# EAGLE schematic MainBoardSchematic (EAGLE 7.2.0)
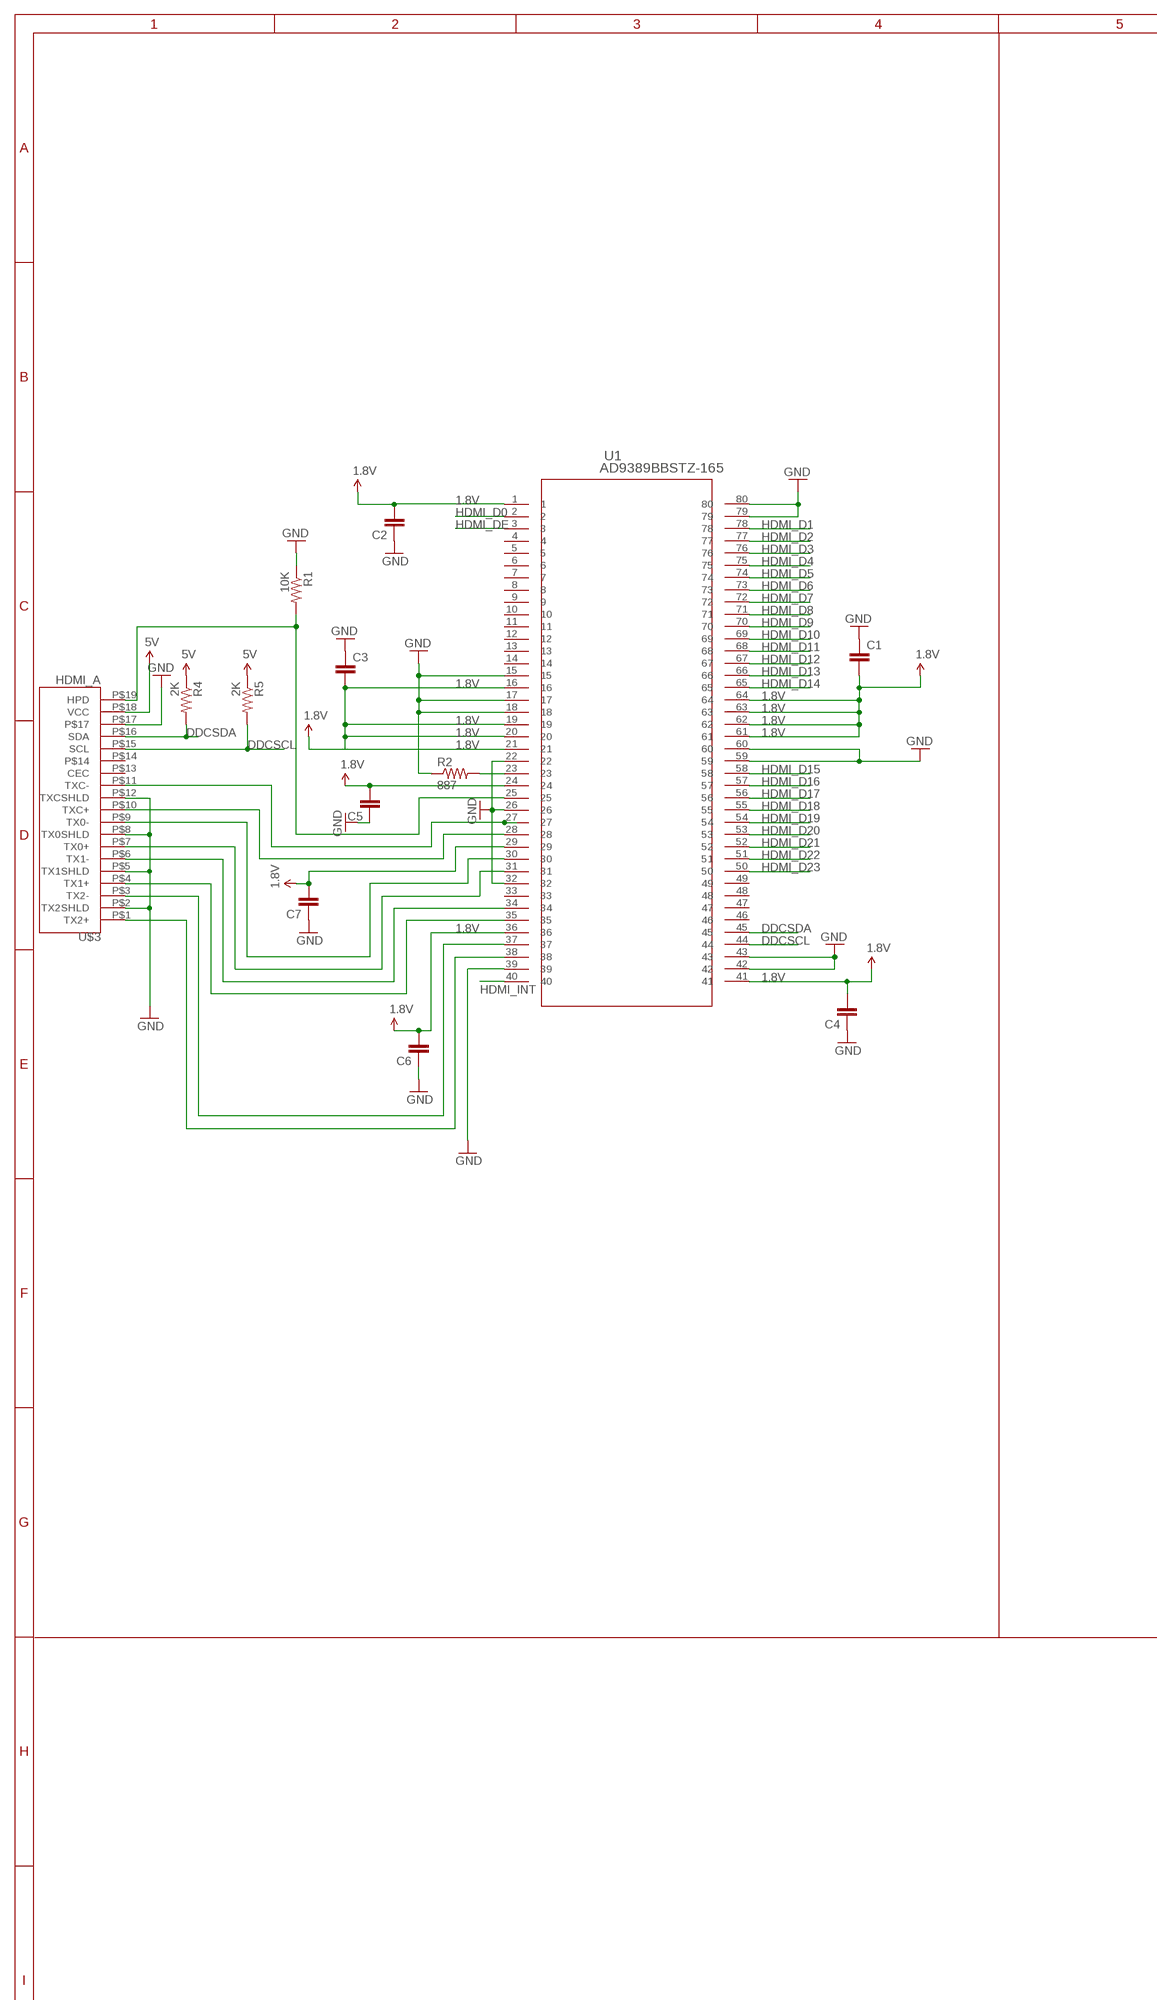
[diagram p0: schematic, sheet 1, part 1 of 2]
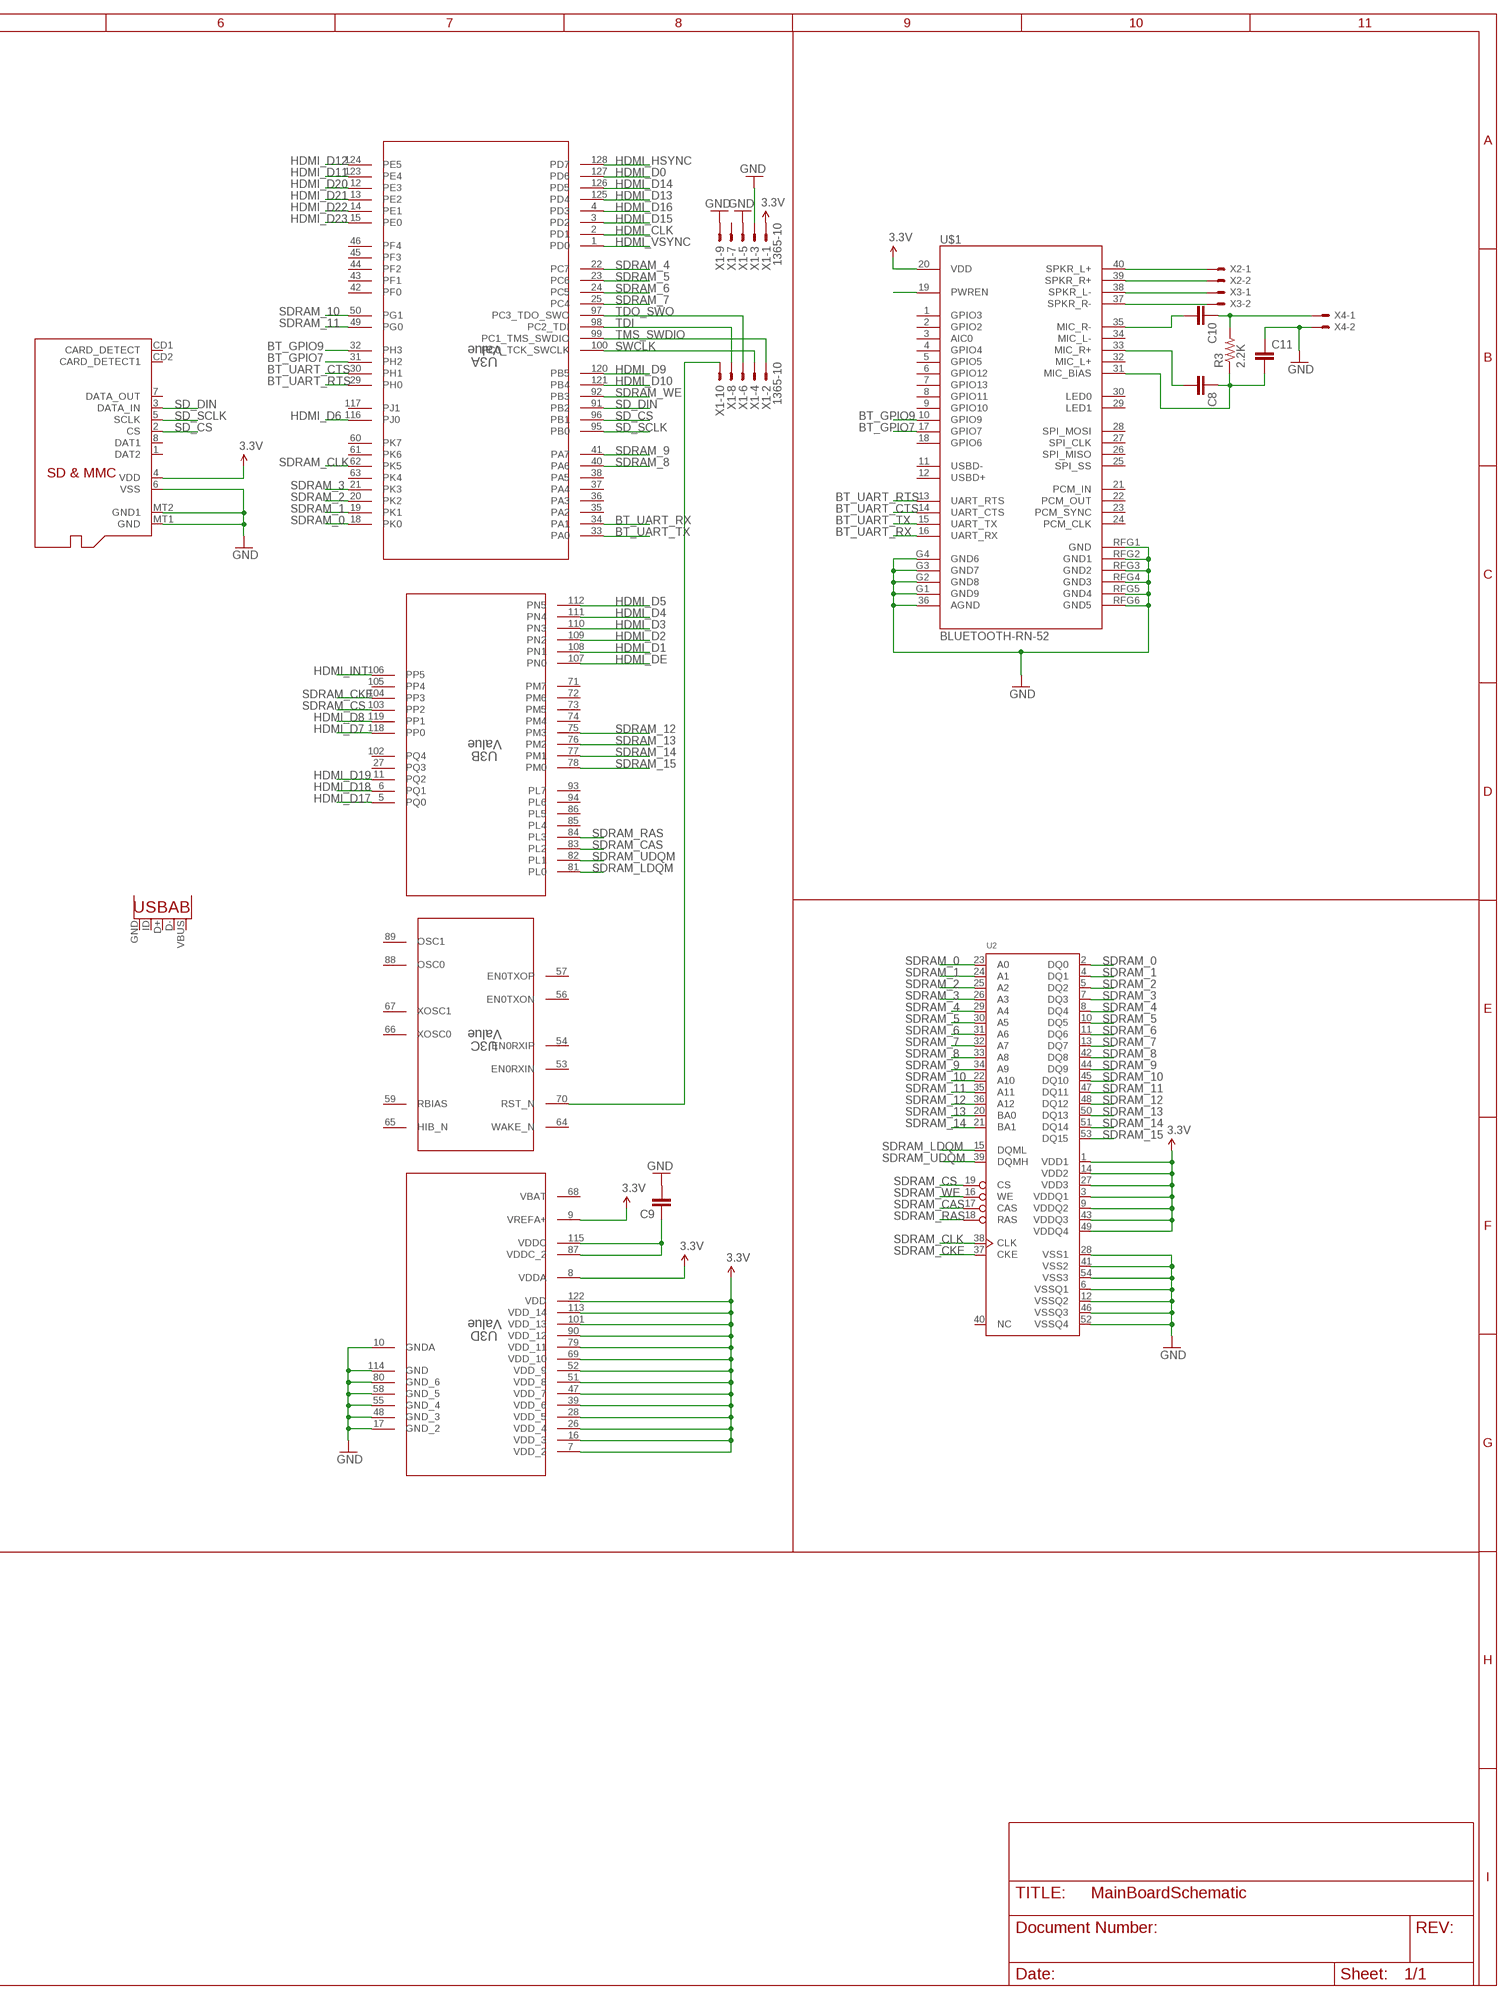
[diagram p1: schematic, sheet 1, part 2 of 2]

## Parts
C1  0.1UF-50V-20%(PTH)KIT-EZ  [CAP-PTH-SMALL-KIT]
C2  0.1UF-50V-20%(PTH)KIT-EZ  [CAP-PTH-SMALL-KIT]
C3  0.1UF-50V-20%(PTH)KIT-EZ  [CAP-PTH-SMALL-KIT]
C4  0.1UF-50V-20%(PTH)KIT-EZ  [CAP-PTH-SMALL-KIT]
C5  0.1UF-50V-20%(PTH)KIT-EZ  [CAP-PTH-SMALL-KIT]
C6  0.1UF-50V-20%(PTH)KIT-EZ  [CAP-PTH-SMALL-KIT]
C7  0.1UF-50V-20%(PTH)KIT-EZ  [CAP-PTH-SMALL-KIT]
C8  0.1UF-50V-20%(PTH)KIT-EZ  [CAP-PTH-SMALL-KIT]
C9  0.1UF-50V-20%(PTH)KIT-EZ  [CAP-PTH-SMALL-KIT]
C10  0.1UF-50V-20%(PTH)KIT-EZ  [CAP-PTH-SMALL-KIT]
C11  0.1UF-50V-20%(PTH)KIT-EZ  [CAP-PTH-SMALL-KIT]
R1  10K  RESISTOR1206  [1206]
R2  887  RESISTOR1206  [1206]
R3  2.2K  RESISTOR1206  [1206]
R4  2K  RESISTOR1206  [1206]
R5  2K  RESISTOR1206  [1206]
U1  AD9389BBSTZ-165  [ST_80_2]
U2  SDRAM_54TSOP  [TSOP54-400]
U3  Value  TM4C129ENCPDTI3R  [PDT0128A_N]
U4  USB-AB  [USB-AB-MICRO-SMD]
U$1  BLUETOOTH-RN-52  [RN-52]
U$2  MICROSD  [MICROSD]
U$3  HDMI_A  [HDMI_A_SMD]
X1  1365-10  [1365-10]
X2  KK-156-2  [KK-156-2]
X3  KK-156-2  [KK-156-2]
X4  KK-156-2  [KK-156-2]

## Nets
1.8V: C1.2 C2.2 C3.2 C4.2 C5.2 C6.2 C7.2 U1.1 U1.16 U1.19 U1.20 U1.21 U1.24 U1.29 U1.36 U1.41 U1.61 U1.62 U1.63 U1.64
3.3V: U2.1(VDD1) U2.3(VDDQ1) U2.9(VDDQ2) U2.14(VDD2) U2.27(VDD3) U2.43(VDDQ3) U2.49(VDDQ4) U3.7(D:VDD_2) U3.8(D:VDDA) U3.9(D:VREFA+) U3.16(D:VDD_3) U3.26(D:VDD_4) U3.28(D:VDD_5) U3.39(D:VDD_6) U3.47(D:VDD_7) U3.51(D:VDD_8) U3.52(D:VDD_9) U3.69(D:VDD_10) U3.79(D:VDD_11) U3.90(D:VDD_12) U3.101(D:VDD_13) U3.113(D:VDD_14) U3.122(D:VDD) U$1.20(VDD) U$2.4(VDD) X1.1
5V: R4.1 R5.1 U$3.P$18(VCC)
BT_GPIO7: U3.31(A:PH2) U$1.17(GPIO7)
BT_GPIO9: U3.32(A:PH3) U$1.10(GPIO9)
BT_UART_CTS: U3.30(A:PH1) U$1.14(UART_CTS)
BT_UART_RTS: U3.29(A:PH0) U$1.13(UART_RTS)
BT_UART_RX: U3.34(A:PA1) U$1.16(UART_RX)
BT_UART_TX: U3.33(A:PA0) U$1.15(UART_TX)
DDCSCL: R5.2 U1.44 U$3.P$15(SCL)
DDCSDA: R4.2 U1.45 U$3.P$16(SDA)
GND: C1.1 C2.1 C3.1 C4.1 C5.1 C6.1 C7.1 C9.2 C11.1 R1.1 R2.1 U1.15 U1.17 U1.18 U1.22 U1.26 U1.32 U1.39 U1.42 U1.43 U1.59 U1.60 U1.79 U1.80 U2.6(VSSQ1) U2.12(VSSQ2) U2.28(VSS1) U2.41(VSS2) U2.46(VSSQ3) U2.52(VSSQ4) U2.54(VSS3) U3.10(D:GNDA) U3.17(D:GND_2) U3.48(D:GND_3) U3.55(D:GND_4) U3.58(D:GND_5) U3.80(D:GND_6) U3.114(D:GND) U$1.36(AGND) U$1.G1(GND9) U$1.G2(GND8) U$1.G3(GND7) U$1.G4(GND6) U$1.RFG1(GND) U$1.RFG2(GND1) U$1.RFG3(GND2) U$1.RFG4(GND3) U$1.RFG5(GND4) U$1.RFG6(GND5) U$2.6(VSS) U$2.MT1(GND) U$2.MT2(GND1) U$3.P$2(TX2SHLD) U$3.P$5(TX1SHLD) U$3.P$8(TX0SHLD) U$3.P$12(TXCSHLD) U$3.P$17 X1.3 X1.5 X1.9 X4.2
HDMI_CLK: U3.2(A:PD1)
HDMI_D0: U1.2 U3.127(A:PD6)
HDMI_D1: U1.78 U3.108(B:PN1)
HDMI_D2: U1.77 U3.109(B:PN2)
HDMI_D3: U1.76 U3.110(B:PN3)
HDMI_D4: U1.75 U3.111(B:PN4)
HDMI_D5: U1.74 U3.112(B:PN5)
HDMI_D6: U1.73 U3.116(A:PJ0)
HDMI_D7: U1.72 U3.118(B:PP0)
HDMI_D8: U1.71 U3.119(B:PP1)
HDMI_D9: U1.70 U3.120(A:PB5)
HDMI_D10: U1.69 U3.121(A:PB4)
HDMI_D11: U1.68 U3.123(A:PE4)
HDMI_D12: U1.67 U3.124(A:PE5)
HDMI_D13: U1.66 U3.125(A:PD4)
HDMI_D14: U1.65 U3.126(A:PD5)
HDMI_D15: U1.58 U3.3(A:PD2)
HDMI_D16: U1.57 U3.4(A:PD3)
HDMI_D17: U1.56 U3.5(B:PQ0)
HDMI_D18: U1.55 U3.6(B:PQ1)
HDMI_D19: U1.54 U3.11(B:PQ2)
HDMI_D20: U1.53 U3.12(A:PE3)
HDMI_D21: U1.52 U3.13(A:PE2)
HDMI_D22: U1.51 U3.14(A:PE1)
HDMI_D23: U1.50 U3.15(A:PE0)
HDMI_DE: U1.3 U3.107(B:PN0)
HDMI_HSYNC: U3.128(A:PD7)
HDMI_INT: U1.40 U3.106(B:PP5)
HDMI_VSYNC: U3.1(A:PD0)
N$1: R1.2 U1.25 U$3.P$19(HPD)
N$2: R2.2 U1.23
N$3: U1.34 U$3.P$6(TX1-)
N$4: U1.30 U$3.P$9(TX0-)
N$5: U1.31 U$3.P$7(TX0+)
N$6: U1.35 U$3.P$4(TX1+)
N$7: U1.37 U$3.P$3(TX2-)
N$8: C8.2 U$1.33(MIC_R+)
N$9: U1.38 U$3.P$1(TX2+)
N$10: U1.28 U$3.P$10(TXC+)
N$11: C10.2 U$1.35(MIC_R-)
N$12: C8.1 C11.2 R3.1 U$1.31(MIC_BIAS)
N$13: C10.1 R3.2 X4.1
N$15: U$1.40(SPKR_L+) X2.1
N$16: U$1.39(SPKR_R+) X2.2
N$17: U$1.38(SPKR_L-) X3.1
N$18: U$1.37(SPKR_R-) X3.2
N$19: U$1.19(PWREN)
N$20: U1.27 U$3.P$11(TXC-)
N$23: C9.1 U3.87(D:VDDC_2) U3.115(D:VDDC)
N$24: U3.70(C:RST_N) X1.10
SD_CS: U3.96(A:PB1) U$2.2(CS)
SD_DIN: U3.91(A:PB2) U$2.3(DATA_IN)
SD_SCLK: U3.95(A:PB0) U$2.5(SCLK)
SDRAM_0: U2.2(DQ0) U2.23(A0) U3.18(A:PK0)
SDRAM_1: U2.4(DQ1) U2.24(A1) U3.19(A:PK1)
SDRAM_2: U2.5(DQ2) U2.25(A2) U3.20(A:PK2)
SDRAM_3: U2.7(DQ3) U2.26(A3) U3.21(A:PK3)
SDRAM_4: U2.8(DQ4) U2.29(A4) U3.22(A:PC7)
SDRAM_5: U2.10(DQ5) U2.30(A5) U3.23(A:PC6)
SDRAM_6: U2.11(DQ6) U2.31(A6) U3.24(A:PC5)
SDRAM_7: U2.13(DQ7) U2.32(A7) U3.25(A:PC4)
SDRAM_8: U2.33(A8) U2.42(DQ8) U3.40(A:PA6)
SDRAM_9: U2.34(A9) U2.44(DQ9) U3.41(A:PA7)
SDRAM_10: U2.22(A10) U2.45(DQ10) U3.50(A:PG1)
SDRAM_11: U2.35(A11) U2.47(DQ11) U3.49(A:PG0)
SDRAM_12: U2.36(A12) U2.48(DQ12) U3.75(B:PM3)
SDRAM_13: U2.20(BA0) U2.50(DQ13) U3.76(B:PM2)
SDRAM_14: U2.21(BA1) U2.51(DQ14) U3.77(B:PM1)
SDRAM_15: U2.53(DQ15) U3.78(B:PM0)
SDRAM_CAS: U2.17(CAS) U3.83(B:PL2)
SDRAM_CKE: U2.37(CKE) U3.104(B:PP3)
SDRAM_CLK: U2.38(CLK) U3.62(A:PK5)
SDRAM_CS: U2.19(CS) U3.103(B:PP2)
SDRAM_LDQM: U2.15(DQML) U3.81(B:PL0)
SDRAM_RAS: U2.18(RAS) U3.84(B:PL3)
SDRAM_UDQM: U2.39(DQMH) U3.82(B:PL1)
SDRAM_WE: U2.16(WE) U3.92(A:PB3)
SWCLK: U3.100(A:PC0_TCK_SWCLK) X1.4
TDI: U3.98(A:PC2_TDI) X1.8
TDO_SWO: U3.97(A:PC3_TDO_SWO) X1.6
TMS_SWDIO: U3.99(A:PC1_TMS_SWDIO) X1.2
Unconnected: U1.4 U1.5 U1.6 U1.7 U1.8 U1.9 U1.10 U1.11 U1.12 U1.13 U1.14 U1.33 U1.46 U1.47 U1.48 U1.49 U2.40(NC) U3.27(B:PQ3) U3.35(A:PA2) U3.36(A:PA3) U3.37(A:PA4) U3.38(A:PA5) U3.42(A:PF0) U3.43(A:PF1) U3.44(A:PF2) U3.45(A:PF3) U3.46(A:PF4) U3.53(C:EN0RXIN) U3.54(C:EN0RXIP) U3.56(C:EN0TXON) U3.57(C:EN0TXOP) U3.59(C:RBIAS) U3.60(A:PK7) U3.61(A:PK6) U3.63(A:PK4) U3.64(C:WAKE_N) U3.65(C:HIB_N) U3.66(C:XOSC0) U3.67(C:XOSC1) U3.71(B:PM7) U3.72(B:PM6) U3.73(B:PM5) U3.74(B:PM4) U3.85(B:PL4) U3.86(B:PL5) U3.88(C:OSC0) U3.89(C:OSC1) U3.93(B:PL7) U3.94(B:PL6) U3.102(B:PQ4) U3.105(B:PP4) U3.117(A:PJ1) U4.D+ U4.D- U4.GND U4.ID(USBID) U4.VBUS U$1.1(GPIO3) U$1.2(GPIO2) U$1.3(AIC0) U$1.4(GPIO4) U$1.5(GPIO5) U$1.6(GPIO12) U$1.7(GPIO13) U$1.8(GPIO11) U$1.9(GPIO10) U$1.11(USBD-) U$1.12(USBD+) U$1.18(GPIO6) U$1.21(PCM_IN) U$1.22(PCM_OUT) U$1.23(PCM_SYNC) U$1.24(PCM_CLK) U$1.25(SPI_SS) U$1.26(SPI_MISO) U$1.27(SPI_CLK) U$1.28(SPI_MOSI) U$1.29(LED1) U$1.30(LED0) U$1.32(MIC_L+) U$1.34(MIC_L-) U$2.1(DAT2) U$2.7(DATA_OUT) U$2.8(DAT1) U$2.CD1(CARD_DETECT) U$2.CD2(CARD_DETECT1) U$3.P$13(CEC) U$3.P$14 X1.7

## Power pins joined to a net without a drawn wire
VBAT: U3.68(D:VBAT)

## Library data of the parts
C1-C11 = SparkFun-Capacitors:0.1UF-50V-20%(PTH): CAP-08370; PROD_ID: CAP-08370
R1-R5 = SparkFun-Passives:RESISTOR: Resistor Basic schematic elements and footprints for 0603, 1206, and PTH resistors.
U1 = HelmetHUD:AD9389BBSTZ-165
U2 = HelmetHUD:SDRAM_54TSOP: 64Mb SDRAM (4Mb x 16) Micron: MT48LC4M16A2P-7E:G TR - 133 MHz, 3V-3.6V, 0-70C - Digikey: 557-1089-1-ND MT48LC4M16A2P-75 IT:G TR - 133 MHz, 3V-3.6V, -40-85C - Digikey: 557-1087-1-ND ISSI (cheaper): IS42S16400F-7TL - 143 MHz, 3V-3.6V, 0-70C - Digikey: 706-1077-ND IS42S16400J-7TLI - 143 MHz, 3V-3.6V, -40-85C - Digikey: 706-1132-ND 256Mb SDRAM (16Mb x 16) MT48LC16M16A2TG-7E IT:D TR - 133MHz, 3V-3.6V, -40-85C - Digikey: 557-1064-1-ND
U3 = HelmetHUD:TM4C129ENCPDTI3R; ALTERNATEPARTNUMBER: TM4C129ENCPDTI3; APPLICATION_BUILDNUMBER: *; COMPTYPE: IC; MANUFACTURER: Texas Instruments; MOUNTTYPE: SMT; PACKAGEREFERENCE: PDT0128A; PARTNUMBER: TM4C129ENCPDTI3R; PIN_COUNT: 128; REFDES: RefDes; ROHS: Y; TYPE: TYPE
U4 = HelmetHUD:USB-AB: This is a USB AB connector that is compatible with USB OTG. i.e. this connector can serve as a host or device
U$1 = HelmetHUD:BLUETOOTH-RN-52
U$2 = HelmetHUD:MICROSD: Micro-SD / Transflash card holder with SPI pinout For the 3M # 2908-05WB-MG and/or 4UCON #19656 push-push type
U$3 = HelmetHUD:HDMI_A
X1 = HelmetHUD:1365-10: DUAL ROW STRAIGHT HEADER 1364 SERIES. 1.27mm x 1.27mm. Without Fixing Post. SMT Source: http://www.leotronics.co.uk/Conexcon/Data%20Sheets/sec.%20A/1364ing.pdf; OC_FARNELL: unknown; OC_NEWARK: unknown
X2-X4 = con-molex:KK-156-2: KK 156 HEADER Source: http://www.molex.com/pdm_docs/sd/026604100_sd.pdf; OC_FARNELL: unknown; OC_NEWARK: unknown